# EAGLE design light_pcb (EAGLE 7.5.0)
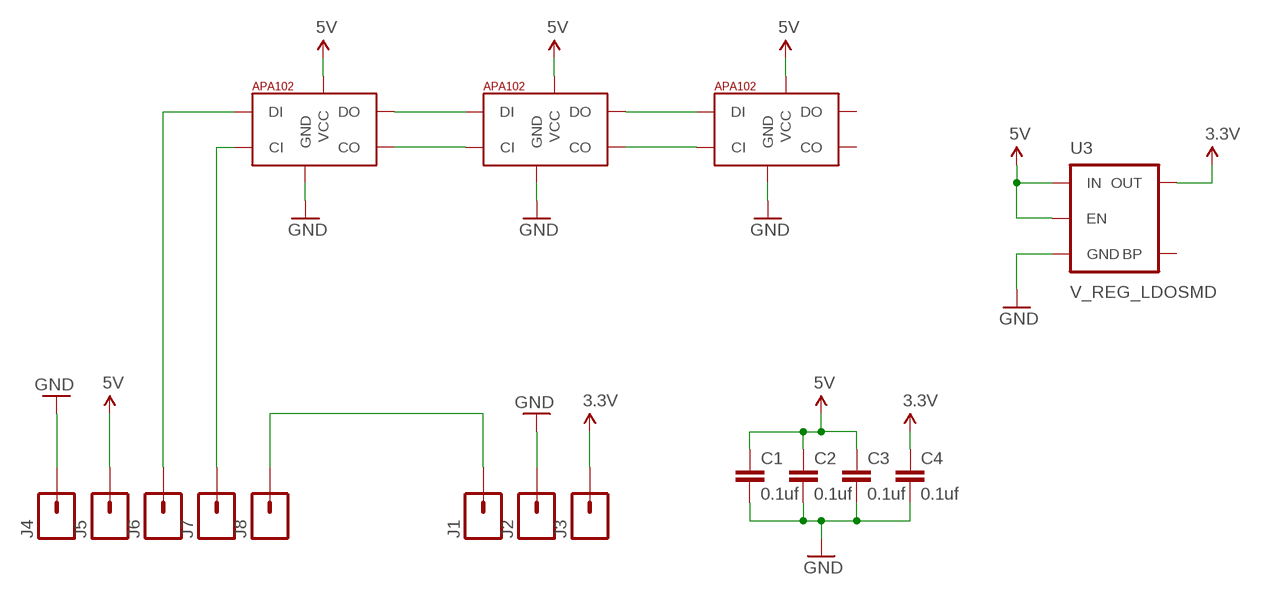
[diagram p0: schematic, sheet 1]

## Parts
C1  0.1uf  CAP0805  [0805]
C2  0.1uf  CAP0805  [0805]
C3  0.1uf  CAP0805  [0805]
C4  0.1uf  CAP0805  [0805]
J1  M01SMD-4.5X1.5  [PAD-1.5X4.5]
J2  M01SMD-4.5X1.5  [PAD-1.5X4.5]
J3  M01SMD-4.5X1.5  [PAD-1.5X4.5]
J4  M01SMD-4.5X1.5  [PAD-1.5X4.5]
J5  M01SMD-4.5X1.5  [PAD-1.5X4.5]
J6  M01SMD-4.5X1.5  [PAD-1.5X4.5]
J7  M01SMD-4.5X1.5  [PAD-1.5X4.5]
J8  M01SMD-4.5X1.5  [PAD-1.5X4.5]
U3  V_REG_LDOSMD  [SOT23-5]
U$1  APA1025050  [APA102_5050]
U$2  APA1025050  [APA102_5050]
U$3  APA1025050  [APA102_5050]

## Nets
3.3V: C4.1 J3.P$1 U3.5(OUT)
5V: C1.1 C2.1 C3.1 J5.P$1 U3.1(IN) U3.3(EN) U$1.1(VCC) U$2.1(VCC) U$3.1(VCC)
GND: C1.2 C2.2 C3.2 C4.2 J2.P$1 J4.P$1 U3.2(GND) U$1.6(GND) U$2.6(GND) U$3.6(GND)
N$1: J6.P$1 U$1.4(DI)
N$2: J7.P$1 U$1.5(CI)
N$3: U$1.3(DO) U$2.4(DI)
N$4: U$1.2(CO) U$2.5(CI)
N$5: U$2.3(DO) U$3.4(DI)
N$6: U$2.2(CO) U$3.5(CI)
N$7: J1.P$1 J8.P$1
Unconnected: U3.4(BP) U$3.2(CO) U$3.3(DO)

## Library data of the parts
C1-C4 = SparkFun-Capacitors:CAP: Capacitor Standard 0603 ceramic capacitor, and 0.1" leaded capacitor.
J1-J8 = SparkFun-Connectors:M01: Header 1 Standard 1-pin 0.1" header. Use with straight break away headers (SKU : PRT-00116), right angle break away headers (PRT-00553), swiss pins (PRT-00743), machine pins (PRT-00117), and female headers (PRT-00115). SMTSO-256-ET is a "flush mount" nut for a 4-40 screw. The older package used to be too tight, and did not allow it to sit properly thru the drill hit. The latest (0.165DIA) fits nice and snug.
U3 = SparkFun-PowerIC:V_REG_LDO: Voltage Regulator LDO Standard 150mA LDO voltage regulator in SOT-23 layout. Micrel part MIC5205. BP (by-pass) pin is used to lower output noise with 470pF cap.
U$1-U$3 = jos-ph:APA102: APA102C 5050 RGB LED -- Adafruit DotStar Single LED Pixel Product Page: https://www.adafruit.com/products/2343 Datasheet: https://cdn-shop.adafruit.com/product-files/2343/APA102C.pdf

## Board
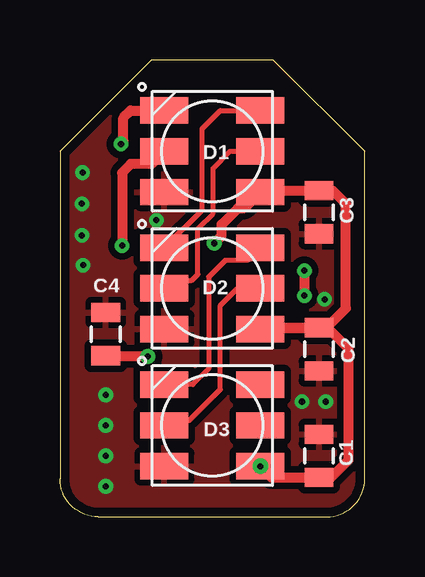
[diagram p1: board, top side]
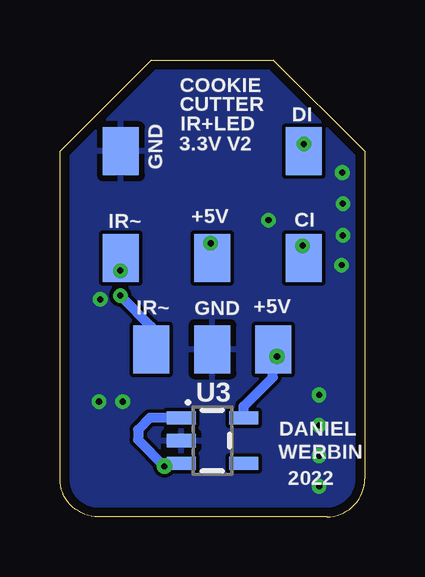
[diagram p2: board, bottom side, seen from below]

Size 12.7 x 19.05 mm. Coordinates in mm from the lower left corner, seen from the top.
Outline: 1.59,0 11.11,0 arc90 12.7,1.59 12.7,15.24 8.89,19.05 3.81,19.05 0,15.24 0,1.59 arc90 1.59,0
Copper layers (1*16): Top 0.0356mm / dielectric 1.5011mm / Bottom 0.0356mm
Design rules "LaenPCBOrder *": minimum track width 6mil, minimum drill 10mil, track to track 6mil, track to pad 6mil, pad to pad 6mil, via to via 6mil, smd to smd 6mil, copper to edge 15mil, drill to drill 6mil, minimum pad ring 7mil, minimum via ring 7mil, stop-mask expansion 3mil, vias tented up to drill 0mil, thermal gap 10mil

### Footprints (pad centres in the part's own frame; a part is rotated, then mirrored left to right if it is on the bottom)
0805 = smd 0.8 x 1.2: 1 -0.9,0; 2 0.9,0
PAD-1.5X4.5 = smd 1.5 x 2: P$1 0,0
SOT23-5 = smd 0.55 x 1.2: 1 -0.95,-1.3; 2 0,-1.3; 3 0.95,-1.3; 4 0.95,1.3; 5 -0.95,1.3
APA102_5050 = smd 2 x 1.1: 1 2,-1.7; 2 2,0; 3 2,1.7; 4 -2,1.7; 5 -2,0; 6 -2,-1.7

### Placement (x,y rotation side)
C1  10.79,2.54 90 top
C2  10.79,6.99 270 top
C3  10.79,12.7 270 top
C4  1.91,7.62 90 top
J1  8.89,6.99 0 bottom
J2  6.35,6.99 0 bottom
J3  3.81,6.99 0 bottom
J4  10.16,15.24 0 bottom
J5  6.35,10.79 0 bottom
J6  2.54,15.24 0 bottom
J7  2.54,10.79 0 bottom
J8  10.16,10.79 0 bottom
U3  6.35,3.17 270 bottom
U$1  6.35,15.24 0 top
U$2  6.35,9.53 0 top
U$3  6.35,3.81 0 top

### Tracks (layer width: path | path; a pad name or v marks a point on that pad's centre or on a via)
3.3V  (via drill 0.25 pad 0.64)
  Top 0.406: v3.66,6.68 1.95,6.68 C4.1
  Bottom 0.406: U3.5 5.05,4.6 3.83,5.82 3.83,6.96 J3.P$1 3.81,6.83 v3.66,6.68
5V  (via drill 0.25 pad 0.51, 0.25 pad 0.64)
  Top 0.406: C2.1 8.41,7.88 U$2.1 8.4,7.87 11.1,7.87 | U$3.1 8.82,1.64 C1.1 11.29,1.64 12.01,2.36 12.01,7.01 11.15,7.87 11.1,7.87 | v6.43,11.4 6.73,11.71 6.73,12.19 7.42,12.88 7.69,12.88 U$1.1 8.41,13.6 C3.1 11.37,13.6 11.91,13.06 11.91,8.69 11.1,7.87
  Bottom 0.406: v6.43,11.4 6.35,11.33 J5.P$1 | U3.1 8.96,4.12 9.45,3.63 9.45,3.21 U$3.1 8.23,2.23 U3.3
  other vias: 8.35,2.11
GND  (via drill 0.25 pad 0.51)
  other vias: 1.91,5.08 1.91,3.81 1.91,2.54 1.91,1.27 10.08,4.8 11.07,4.8 0.97,10.49 0.91,11.73 0.91,13.06 0.94,14.35 11.02,9.07 4.01,12.37
  pour Top (isolate 0.279): 1.27,0 0,1.32 0.05,15.21 3.89,19.05 8.97,19 12.7,15.16 12.8,1.65 11.56,-0.1 1.27,-0.05
  pour Bottom: 1.27,0 0,1.27 0,15.24 3.81,19.05 8.89,19.05 12.7,15.24 12.7,1.27 11.43,0
N$1  (via drill 0.25 pad 0.51)
  Top 0.406: v2.54,15.54 2.64,15.65 2.64,16.64 2.94,16.94 U$1.4
  Bottom 0.406: J6.P$1 v2.54,15.54
N$2  (via drill 0.25 pad 0.51)
  Top 0.406: U$1.5 3.82,14.71 2.95,14.71 2.59,14.35 v2.59,11.3
  Bottom 0.406: v2.59,11.3 2.54,11.25 J7.P$1
N$3
  Top 0.203: U$2.4 5.92,12.79 5.92,16.18 6.68,16.94 U$1.3
N$4
  Top 0.203: U$2.5 4.68,9.86 5.49,9.86 5.74,10.11 5.74,12.01 6.38,12.65 6.38,14.53 7.09,15.24 U$1.2
N$5
  Top 0.203: U$2.3 7.82,10.69 6.88,10.69 6.2,10.01 6.2,6.17 5.54,5.51 U$3.4
N$6
  Top 0.203: U$3.5 4.55,4.01 5.38,4.01 6.68,5.31 6.68,8.81 7.39,9.53 U$2.2
N$7  (via drill 0.25 pad 0.51)
  Top 0.406: v10.19,10.26 v10.19,9.22
  Bottom 0.406: J8.P$1 10.19,10.77 v10.19,10.26 | v10.19,9.22 8.89,7.92 J1.P$1

### Text on the board
tPlace: D1 | C3 | C4 | D2 | C2 | D3 | C1
bPlace: COOKIE | CUTTER | DI | IR+LED | 3.3V V2 | GND | CI | +5V | IR~ | +5V | GND | IR~ | U3 | DANIEL | WERBIN | 2022